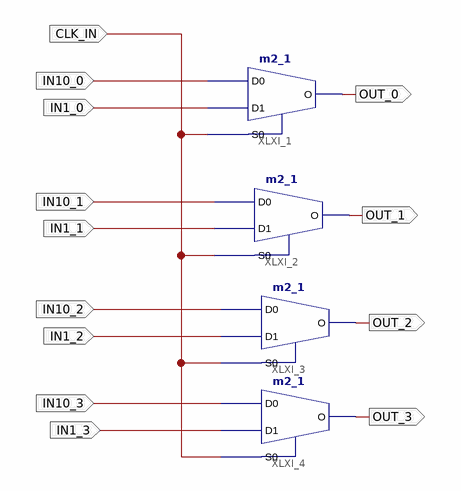
[diagram p0: schematic sheet 1]
// Xilinx ISE schematic MULTIPLEX.sch (spartan6) as structural Verilog: 4 symbols, 13 ports
module MULTIPLEX (
  input  IN10_0,
  input  IN1_0,
  input  IN10_1,
  input  IN1_1,
  input  IN10_2,
  input  IN1_2,
  input  IN10_3,
  input  IN1_3,
  input  CLK_IN,
  output OUT_0,
  output OUT_1,
  output OUT_2,
  output OUT_3
);

  m2_1 XLXI_1 (.D0(IN10_0), .D1(IN1_0), .S0(CLK_IN), .O(OUT_0));
  m2_1 XLXI_2 (.D0(IN10_1), .D1(IN1_1), .S0(CLK_IN), .O(OUT_1));
  m2_1 XLXI_3 (.D0(IN10_2), .D1(IN1_2), .S0(CLK_IN), .O(OUT_2));
  m2_1 XLXI_4 (.D0(IN10_3), .D1(IN1_3), .S0(CLK_IN), .O(OUT_3));
endmodule
